# Altium schematic sheet [03] - CPU - IO.SchDoc: DOCUMENT TITLE
size A4; Organization: Tor Brodtkorb; Address1: Frode Rinnans veg 193; Address2: 7050 Trondheim; DocumentNumber: 6598; Revision: 1.0; SheetNumber: 1; SheetTotal: 1
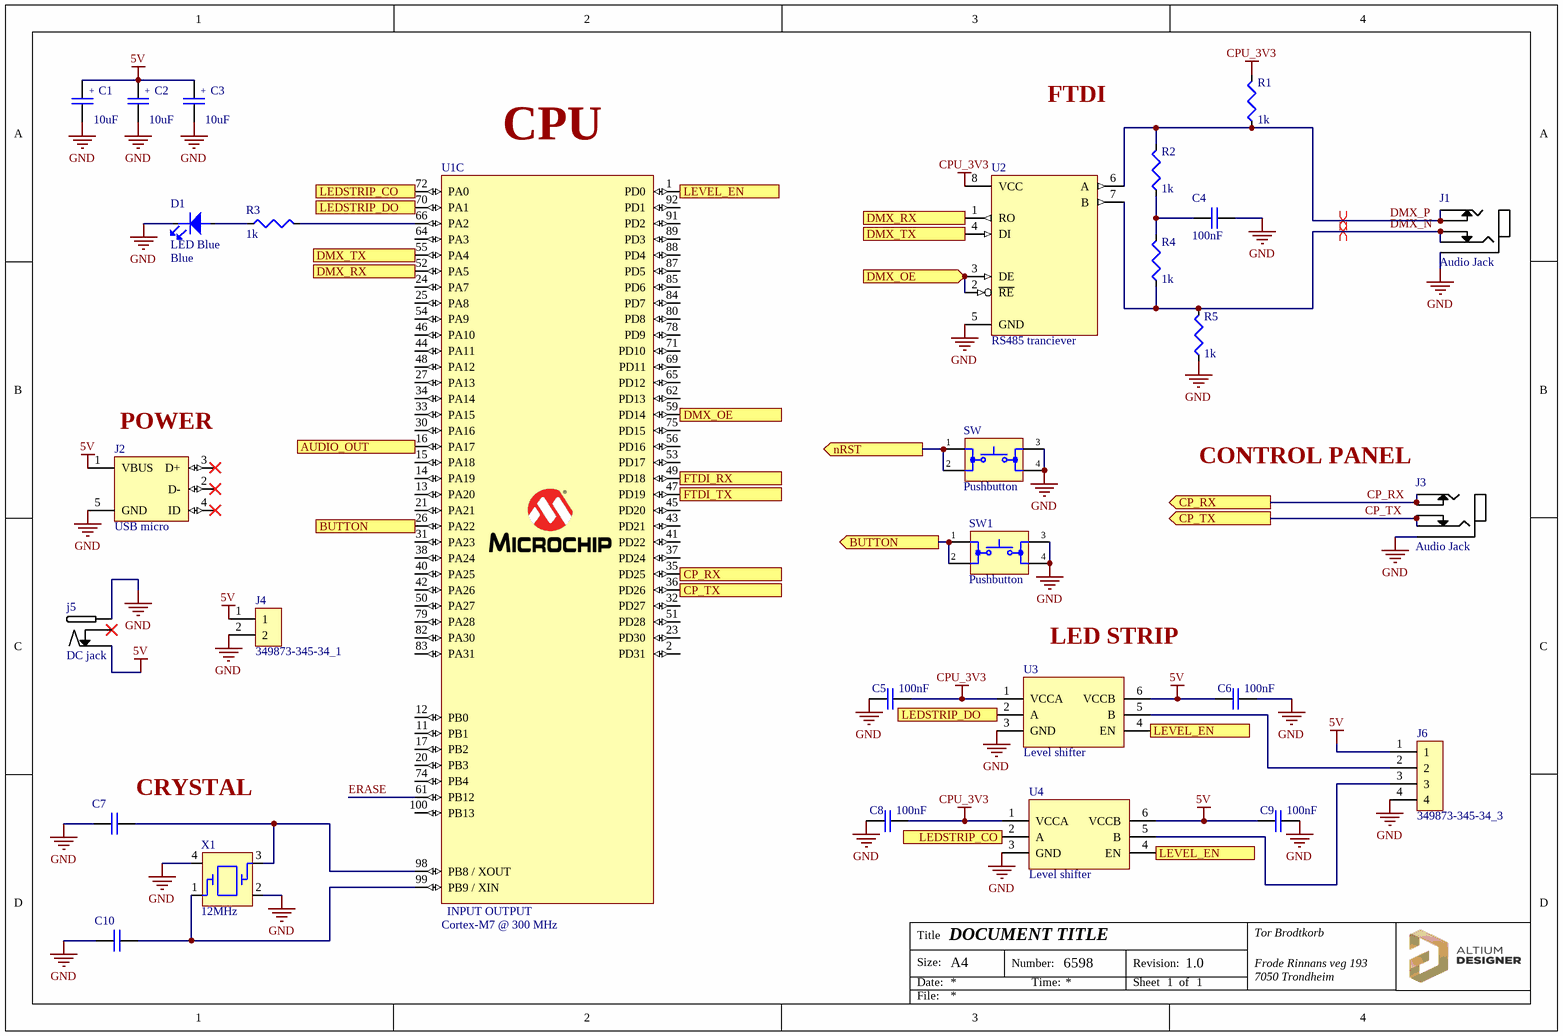
[diagram p0: [03] - CPU - IO.SchDoc]

## Parts
C1  value 10uF  [Capacitor electrolytic SMD 4x5.4]  (hidden comment: EEE1HA2R2SR)
C2  value 10uF  [Capacitor electrolytic SMD 4x5.4]  (hidden comment: EEE1HA2R2SR)
C3  value 10uF  [Capacitor electrolytic SMD 4x5.4]  (hidden comment: EEE1HA2R2SR)
C4  value 100nF  [C0603]  (hidden comment: 02016D104KAT2A)
C5  value 100nF  [C0603]  (hidden comment: 02016D104KAT2A)
C6  value 100nF  [C0603]  (hidden comment: 02016D104KAT2A)
C7  02016D104KAT2A  [C0603]  (value not drawn)
C8  value 100nF  [C0603]  (hidden comment: 02016D104KAT2A)
C9  value 100nF  [C0603]  (hidden comment: 02016D104KAT2A)
C10  02016D104KAT2A  [C0603]  (value not drawn)
D1  LED Blue  Color: Blue  [L0603 BLUE]
J1  Audio Jack  [Audio jack flat]
J2  USB micro  [USB micro]
J3  Audio Jack  [Audio jack flat]
J4  349873-345-34_1  [Header 1x2 male]
j5  DC jack  [DC power jack]
J6  349873-345-34_3  [Header 1x4 male]
R1  value 1k  [R0603]  (hidden comment: CPF-A-0603B100KE1)
R2  value 1k  [R0603]  (hidden comment: CPF-A-0603B100KE1)
R3  value 1k  [R0603]  (hidden comment: CPF-A-0603B100KE1)
R4  value 1k  [R0603]  (hidden comment: CPF-A-0603B100KE1)
R5  value 1k  [R0603]  (hidden comment: CPF-A-0603B100KE1)
SW  Pushbutton  [KSC222G LFS]
SW1  Pushbutton  [KSC222G LFS]
U1  Cortex-M7 @ 300 MHz  [ATSAMS70N19A-AN]  (part C of 3)
U2  RS485 tranciever  [SP3485EN]
U3  Level shifter  [ADG3301BKSZ]
U4  Level shifter  [ADG3301BKSZ]
X1  12MHz  [MCSJK-7U-12.00-12-30-80-B-30]

## Ports
AUDIO_OUT (in), BUTTON (in), BUTTON (out), CP_RX (out), CP_TX (out), DMX_OE (in), DMX_OE (out), DMX_RX (in), DMX_RX (out), DMX_TX (in), DMX_TX (out), FTDI_RX (out), FTDI_TX (out), LEDSTRIP_CO (in), LEDSTRIP_CO (out), LEDSTRIP_DO (in), LEDSTRIP_DO (out), LEVEL_EN (in), LEVEL_EN (out), nRST (out)

## Nets
5V: C1.1 C2.1 C3.1 C6.1 C9.1 J2.1(VBUS) J4.1 j5.1 J6.1 U3.6(VCCB) U4.6(VCCB)
CPU_3V3: C5.2 C8.2 R1.2 U2.8(VCC) U3.1(VCCA) U4.1(VCCA)
GND: C1.2 C2.2 C3.2 C4.1 C5.1 C6.2 C7.2 C8.1 C9.2 C10.2 D1.2 J1.1 J2.5(GND) J3.1 J4.2 j5.3 J6.4 R5.1 SW.3 SW.4 SW1.3 SW1.4 U2.5(GND) U3.3(GND) U4.3(GND) X1.2 X1.4
AUDIO_OUT: U1.16(PA17) ; port AUDIO_OUT
BUTTON: SW1.1 SW1.2 U1.26(PA22) ; port BUTTON
CP_RX: J3.4 J3.5 U1.35(PD25) ; port CP_RX
CP_TX: J3.2 J3.3 U1.36(PD26) ; port CP_TX
DMX_N: J1.2 J1.3 R4.1 R5.2 U2.7(B)
DMX_OE: U1.59(PD14) U2.2(~{RE}) U2.3(DE) ; port DMX_OE
DMX_P: J1.4 J1.5 R1.1 R2.2 U2.6(A)
DMX_RX: U1.52(PA5) U2.1(RO) ; port DMX_RX
DMX_TX: U1.55(PA4) U2.4(DI) ; port DMX_TX
ERASE: U1.61(PB12)
FTDI_RX: U1.49(PD18) ; port FTDI_RX
FTDI_TX: U1.47(PD19) ; port FTDI_TX
LEDSTRIP_CO: U1.72(PA0) U4.2(A) ; port LEDSTRIP_CO
LEDSTRIP_DO: U1.70(PA1) U3.2(A) ; port LEDSTRIP_DO
LEVEL_EN: U1.1(PD0) U3.4(EN) U4.4(EN) ; port LEVEL_EN
nRST: SW.1 SW.2 ; port nRST
NetC4_2: C4.2 R2.1 R4.2
NetC7_1: C7.1 U1.98(PB8_/_XOUT) X1.3
NetC10_1: C10.1 U1.99(PB9_/_XIN) X1.1
NetD1_1: D1.1 R3.1
NetJ6_2: J6.2 U3.5(B)
NetJ6_3: J6.3 U4.5(B)
NetR3_2: R3.2 U1.66(PA2)

Not connected (* = marked no-connect by the designer): J2 2(D-)* 3(D+)* 4(ID)*; j5 2*; U1 2(PD31) 11(PB1) 12(PB0) 13(PA20) 14(PA19) 15(PA18) 17(PB2) 20(PB3) 21(PA21) 23(PD30) 24(PA7) 25(PA8) 27(PA13) 30(PA16) 31(PA23) 32(PD27) 33(PA15) 34(PA14) 37(PD24) 38(PA24) 40(PA25) 41(PD22) 42(PA26) 43(PD21) 44(PA11) 45(PD20) 46(PA10) 48(PA12) 50(PA27) 51(PD28) 53(PD17) 54(PA9) 56(PD16) 62(PD13) 64(PA3) 65(PD12) 69(PD11) 71(PD10) 74(PB4) 75(PD15) 78(PD9) 79(PA28) 80(PD8) 82(PA30) 83(PA31) 84(PD7) 85(PD6) 87(PD5) 88(PD4) 89(PD3) 91(PD2) 92(PD1) 100(PB13)

## Layout directives
differential pair: DMX_N, DMX_P

## Notes on the sheet
- FTDI
- (near U1) CPU
- (near J2) POWER
- CONTROL PANEL
- LED STRIP
- (near C7) CRYSTAL
- Title
- Size:
- Date:
- A4
- Number:
- Time:
- Revision:
- Sheet
- of
- File:
- (in symbol ATSAMS70N19A-AN, part C) INPUT OUTPUT
- (in symbol EEE1HA2R2SR) +

## Library data of the parts
C1-C3 = EEE1HA2R2SR: El. Capacitor SMD 4x5.4
C4-C10 = 02016D104KAT2A: C0603
D1 = HSMG-C199: LED 0603 Blue
J1 J3 = FC68133: Audio jack flat 5 contacts; Supplier Part Number 1: 2518190; Supplier 1: Farnell
J2 = 47590-0001: Supplier Part Number 1: 1568022; Supplier 1: Farnell
J4 = 349873-345-34_1: Header 1x2 male 2.54mm
j5 = 694106301002: DC power jack
J6 = 349873-345-34_3: Header 1x4 male 2.54mm
R1-R5 = CPF-A-0603B100KE1: R0603
SW SW1 = KSC222G LFS: Pushbutton SMD; Supplier Part Number 1: 2845714; Supplier 1: Farnell
U1 = ATSAMS70N19A-AN: ATSAMS70N19; Supplier Part Number 1: 2484390; Supplier 1: Farnell
U2 = SP3485EN: RS485 tranciever 3V3
U3 U4 = ADG3301BKSZ: Level shifter 1-bit bidirectional
X1 = MCSJK-7U-12.00-12-30-80-B-30: Crystal 12MHz 3.2mm x 2.5mm; Supplier Part Number 1: 2853917; Supplier 1: Farnell